# Altium schematic sheet Power5V.SchDoc
size 312 x 144 mm; SheetNumber: 1; SheetTotal: 1
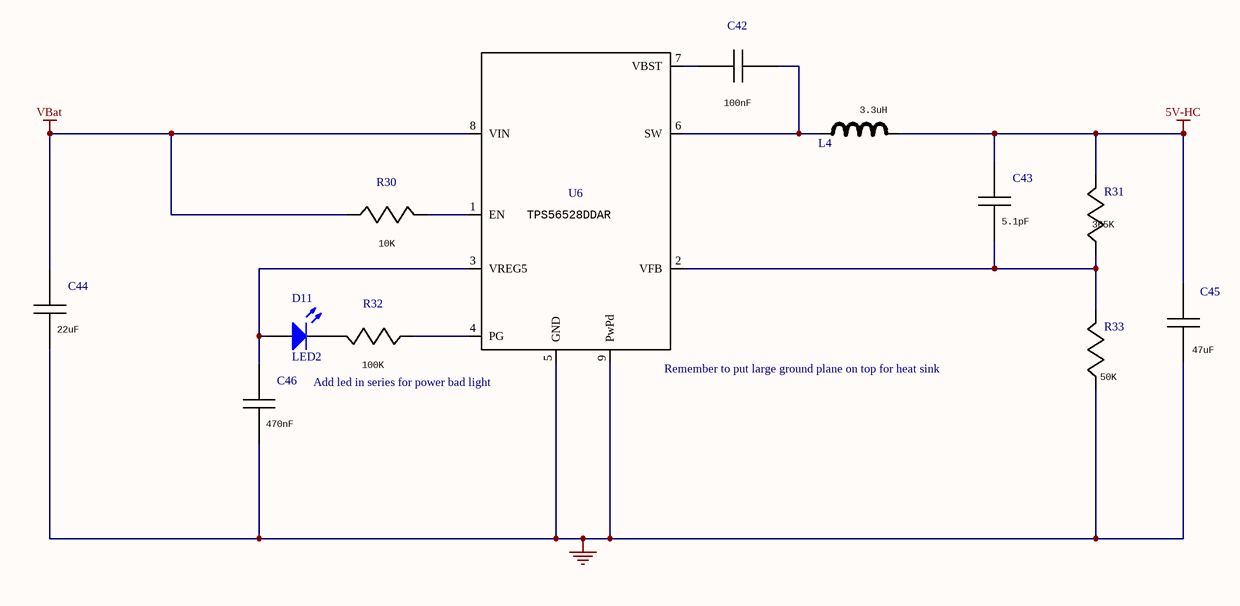
[diagram p0: Power5V.SchDoc]

## Parts
C42  value 100nF  [1608]  (hidden comment: C1005X5R1A104K)
C43  value 5.1pF  [1608]  (hidden comment: GRM1555C1E5R1CA0)
C44  value 22uF  [1210]  (hidden comment: GRM32ER61E226KE1)
C45  value 47uF  [1210]  (hidden comment: C3216X6S1A476M)
C46  value 470nF  [1608]  (hidden comment: GRM155R61A474KE1)
D11  LED2  [1608[0603]]
L4  value 3.3uH  [IHLP-3232DZ]  (hidden comment: IHLP3232DZER3R3M)
R30  value 10K  [1608]  (hidden comment: CRCW040210K0FKED)
R31  value 365K  [1608]  (hidden comment: CRCW0402365KFKED)
R32  value 100K  [1608]  (hidden comment: CRCW0402100KFKED)
R33  value 50K  [1608]  (hidden comment: CRCW040249K9FKED)
U6  TPS56528DDAR  [R-PDSO-G8]

## Nets
5V-HC: C43.1 C45.1 L4.2 R31.1
GND: C44.2 C45.2 C46.2 R33.2 U6.5(GND) U6.9(PwPd)
VBat: C44.1 R30.2 U6.8(VIN)
NetC42_1: C42.1 U6.7(VBST)
NetC42_2: C42.2 L4.1 U6.6(SW)
NetC43_2: C43.2 R31.2 R33.1 U6.2(VFB)
NetC46_1: C46.1 D11.1(A) U6.3(VREG5)
NetD11_2: D11.2(K) R32.1
NetR30_1: R30.1 U6.1(EN)
NetR32_2: R32.2 U6.4(PG)

## Notes on the sheet
- Add led in series for power bad light
- (near U6) Remember to put large ground plane on top for heat sink

## Library data of the parts
C42 = C1005X5R1A104K: Imported; Vendor: TDK; rn: Cbst; Manufacturer_Part_Number: C1005X5R1A104K; Manufacturer_Name: TDK; RefDes: RefDes; TYPE: TYPE
C43 = GRM1555C1E5R1CA0: Imported; Manufacturer_Part_Number: GRM1555C1E5R1CA01D; Vendor: MuRata; rn: Cff; Manufacturer_Name: MuRata; RefDes: RefDes; TYPE: TYPE
C44 = GRM32ER61E226KE1: Imported; Manufacturer_Part_Number: GRM32ER61E226KE15L; Vendor: MuRata; rn: Cin; Manufacturer_Name: MuRata; RefDes: RefDes; TYPE: TYPE
C45 = C3216X6S1A476M: Imported; Vendor: TDK; rn: Cout; Manufacturer_Part_Number: C3216X6S1A476M; Manufacturer_Name: TDK; RefDes: RefDes; TYPE: TYPE
C46 = GRM155R61A474KE1: Imported; Manufacturer_Part_Number: GRM155R61A474KE15D; Vendor: MuRata; rn: Creg; Manufacturer_Name: MuRata; RefDes: RefDes; TYPE: TYPE
D11 = LED2: Typical RED, GREEN, YELLOW, AMBER GaAs LED; Published: 8-Jun-2000; LatestRevisionDate: 17-Jul-2002; LatestRevisionNote: Re-released for DXP Platform.; PackageVersion: Feb-2002; PackageReference: 3.2X1.6X1.1; Publisher: Altium Limited; PackageDescription: SM LED; 2 Flat Leads
L4 = IHLP3232DZER3R3M: Imported; Manufacturer_Part_Number: IHLP3232DZER3R3M01; Manufacturer: Vishay; Vendor: Vishay-Dale; PACKAGE_DESIGNATOR: IHLP-3232DZ; Manufacturer_Name: Vishay-Dale; RefDes: RefDes; TYPE: TYPE
R30 = CRCW040210K0FKED: Imported; Vendor: Vishay-Dale; rn: Ren; Manufacturer_Part_Number: CRCW040210K0FKED; Manufacturer_Name: Vishay-Dale; RefDes: RefDes; TYPE: TYPE
R31 = CRCW0402365KFKED: Imported; Vendor: Vishay-Dale; rn: Rfbt; Manufacturer_Part_Number: CRCW0402365KFKED; Manufacturer_Name: Vishay-Dale; RefDes: RefDes; TYPE: TYPE
R32 = CRCW0402100KFKED: Imported; Vendor: Vishay-Dale; rn: Rpgood; Manufacturer_Part_Number: CRCW0402100KFKED; Manufacturer_Name: Vishay-Dale; RefDes: RefDes; TYPE: TYPE
R33 = CRCW040249K9FKED: Imported; Vendor: Vishay-Dale; rn: Rfbb; Manufacturer_Part_Number: CRCW040249K9FKED; Manufacturer_Name: Vishay-Dale; RefDes: RefDes; TYPE: TYPE
U6 = TPS56528DDAR: Imported; Vendor: Texas Instruments; Value: Value; Manufacturer_Part_Number: TPS56528DDAR; Manufacturer_Name: Texas Instruments; RefDes: RefDes; TYPE: TYPE